# EAGLE design arm_new_v2 (EAGLE 7.5.0)
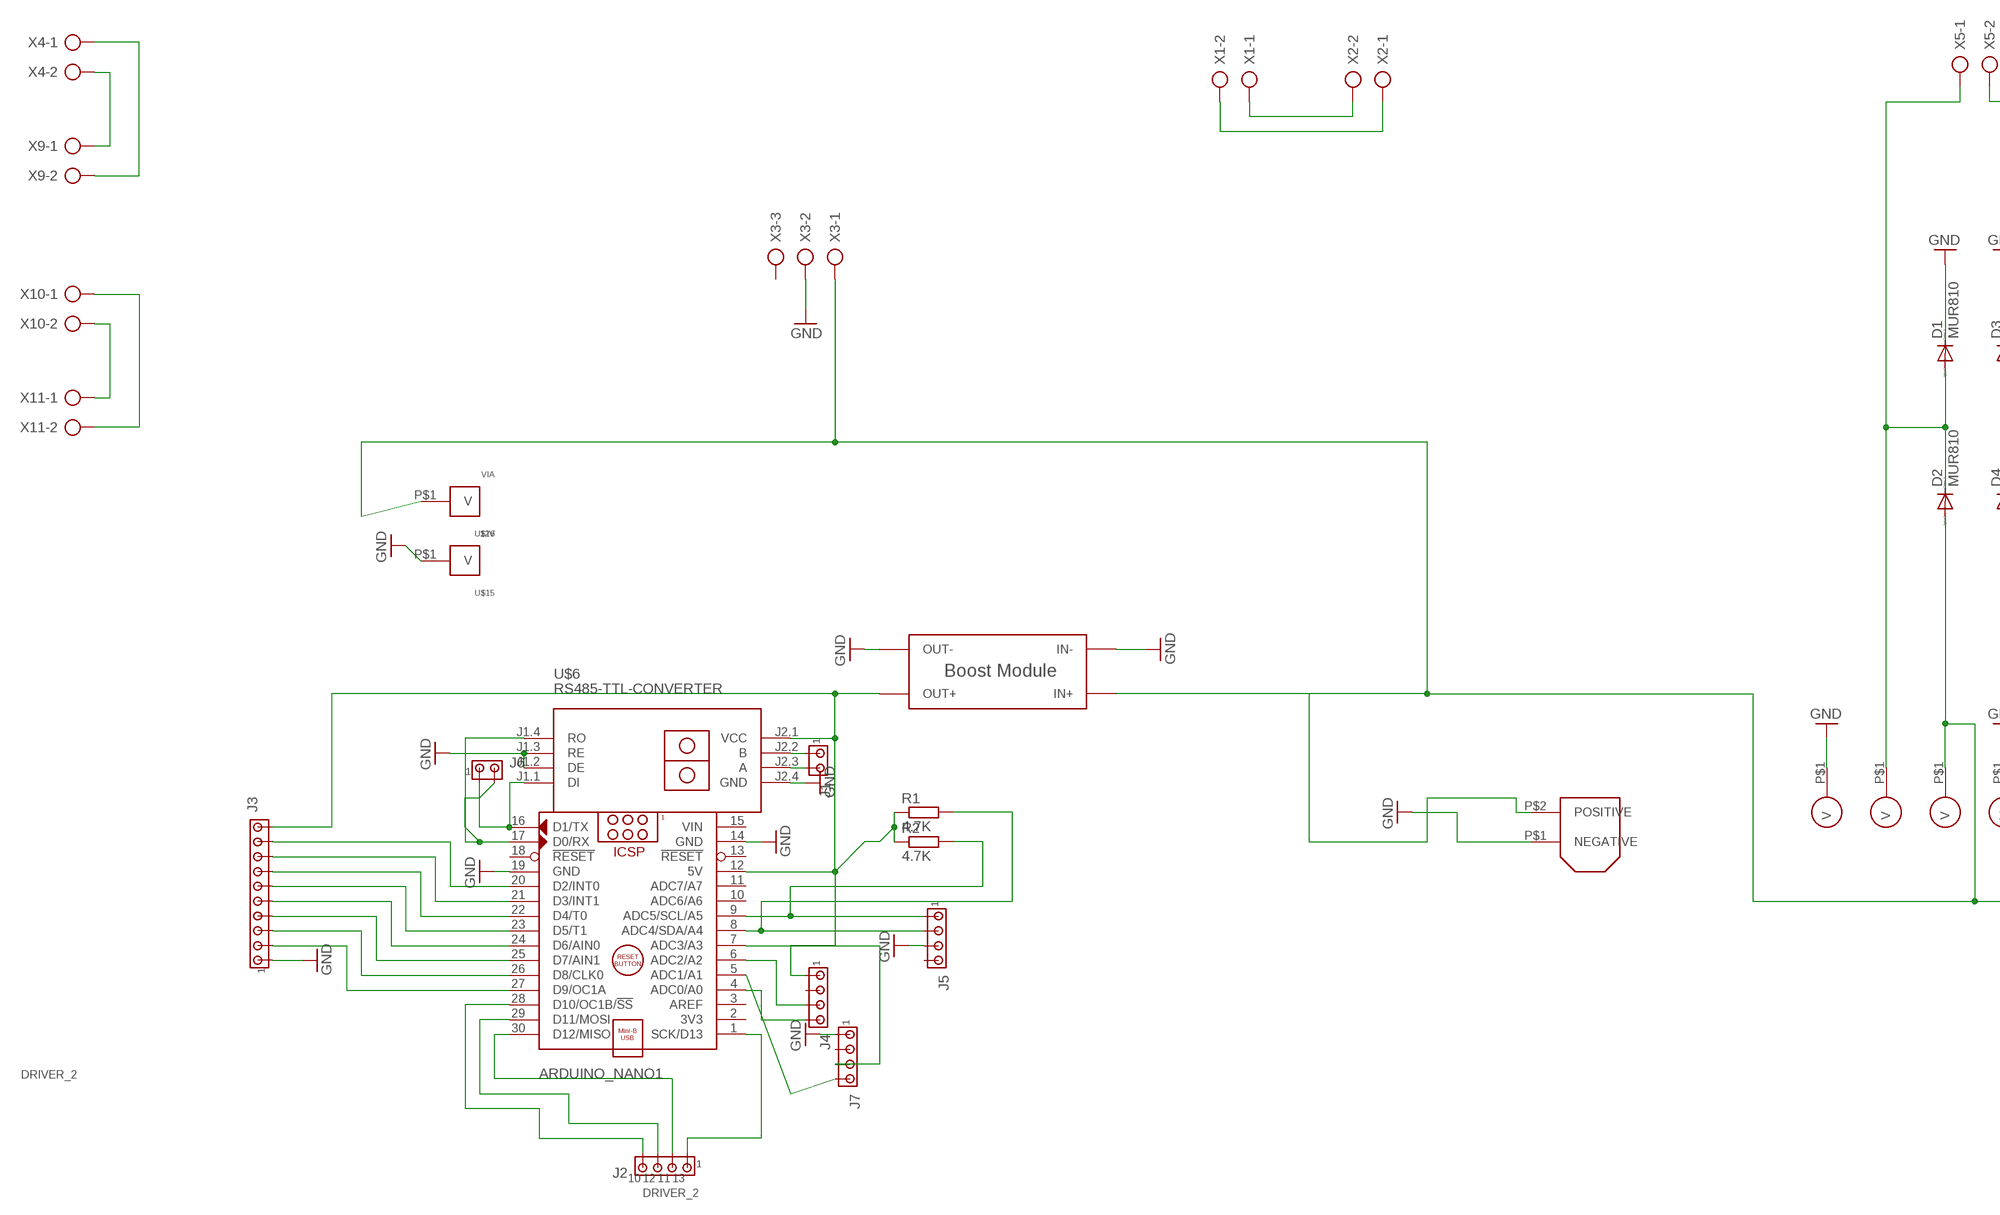
[diagram p0: schematic, sheet 1, part 1 of 2]
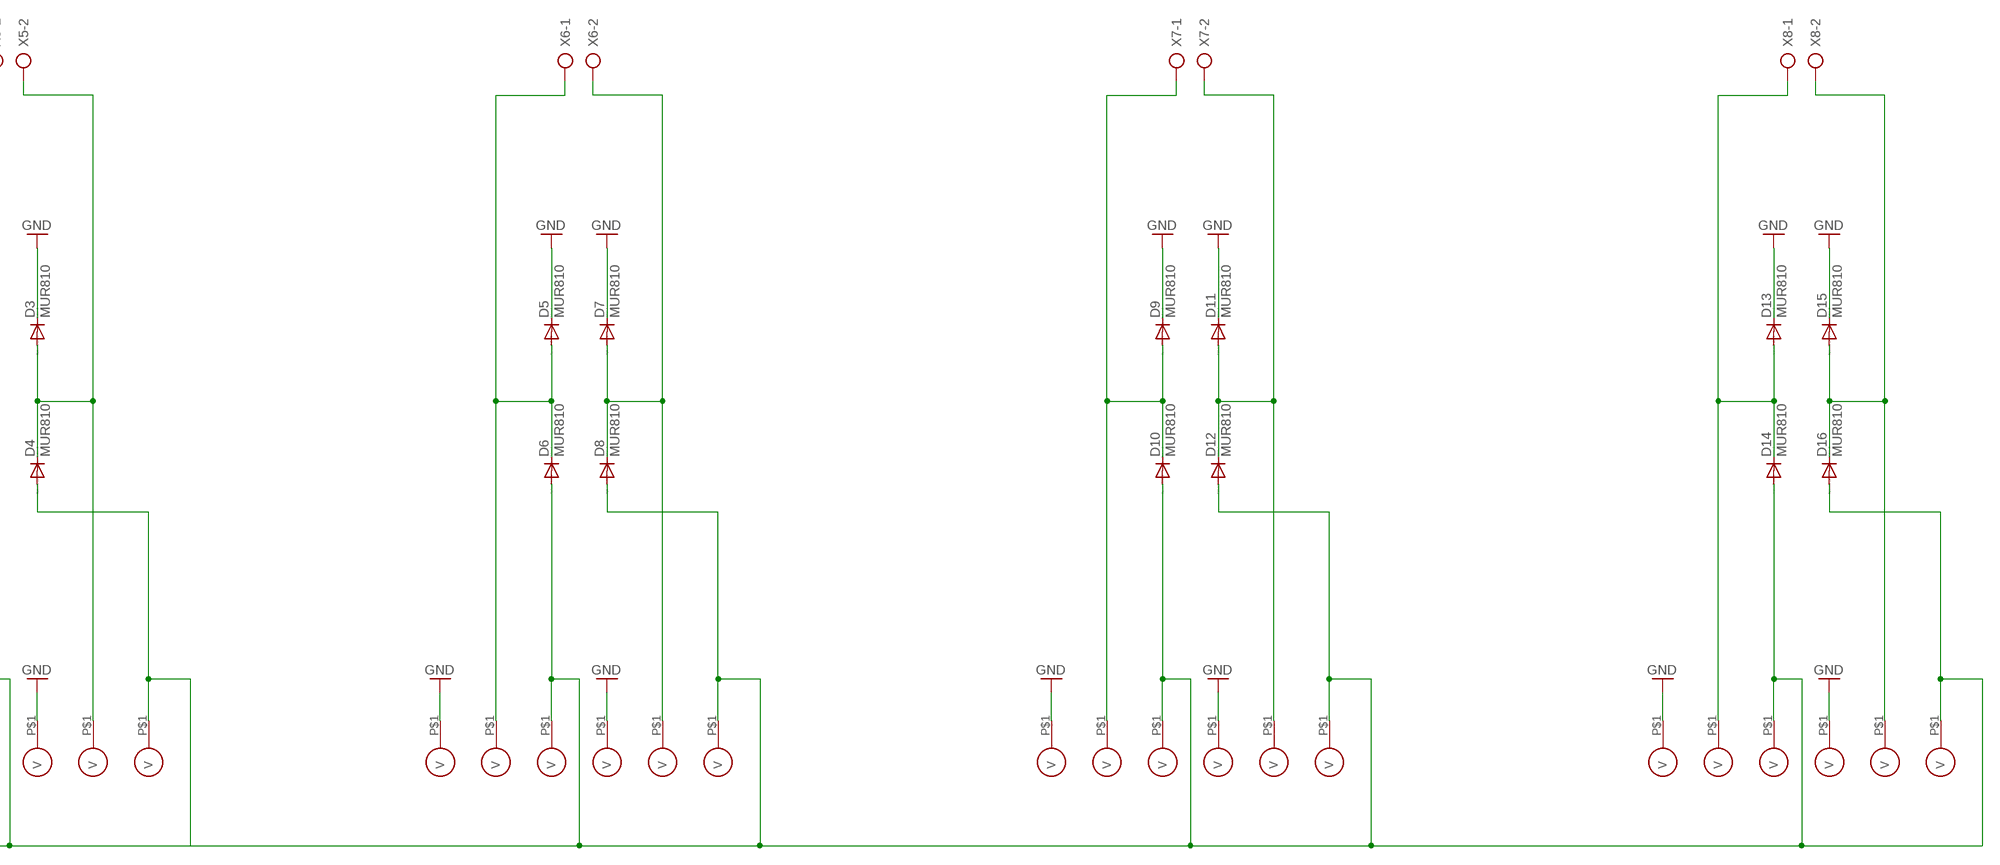
[diagram p1: schematic, sheet 1, part 2 of 2]

## Parts
ARDUINO_NANO1  ARDUINO_NANO  [ARDUINO_NANO]
D1  MUR810  [TO220ACS]
D2  MUR810  [TO220ACS]
D3  MUR810  [TO220ACS]
D4  MUR810  [TO220ACS]
D5  MUR810  [TO220ACS]
D6  MUR810  [TO220ACS]
D7  MUR810  [TO220ACS]
D8  MUR810  [TO220ACS]
D9  MUR810  [TO220ACS]
D10  MUR810  [TO220ACS]
D11  MUR810  [TO220ACS]
D12  MUR810  [TO220ACS]
D13  MUR810  [TO220ACS]
D14  MUR810  [TO220ACS]
D15  MUR810  [TO220ACS]
D16  MUR810  [TO220ACS]
J1  MTA02-100  [10X02MTA]
J2  MTA04-100  [10X04MTA]
J3  MTA10-100  [10X10MTA]
J4  MTA04-100  [10X04MTA]
J5  MTA04-100  [10X04MTA]
J6  MTA02-100  [10X02MTA]
J7  MTA04-100  [10X04MTA]
NO  NO  ROUND_VIA  [ROUND_VIA]
NO1  NO  ROUND_VIA  [ROUND_VIA]
NO2  NO  ROUND_VIA  [ROUND_VIA]
NO3  NO  ROUND_VIA  [ROUND_VIA]
R1  4.7K  R-EU_0204/7  [0204/7]
R2  4.7K  R-EU_0204/7  [0204/7]
U$1  BOOST_MODULE  [BOOST_MODULE]
U$4  XT60  [CONNECTOR]
U$6  RS485-TTL-CONVERTER  [RS485-TTL-CONVERTER]
U$15  12V  VIA  [VIA]
U$16  VIA  [VIA]
U$17  ROUND_VIA  [ROUND_VIA]
U$18  ROUND_VIA  [ROUND_VIA]
U$19  ROUND_VIA  [ROUND_VIA]
U$20  ROUND_VIA  [ROUND_VIA]
U$21  ROUND_VIA  [ROUND_VIA]
U$22  ROUND_VIA  [ROUND_VIA]
U$23  ROUND_VIA  [ROUND_VIA]
U$24  ROUND_VIA  [ROUND_VIA]
U$25  ROUND_VIA  [ROUND_VIA]
U$26  ROUND_VIA  [ROUND_VIA]
U$27  ROUND_VIA  [ROUND_VIA]
U$28  ROUND_VIA  [ROUND_VIA]
U$29  ROUND_VIA  [ROUND_VIA]
U$30  ROUND_VIA  [ROUND_VIA]
U$31  ROUND_VIA  [ROUND_VIA]
U$32  ROUND_VIA  [ROUND_VIA]
U$33  ROUND_VIA  [ROUND_VIA]
U$34  ROUND_VIA  [ROUND_VIA]
U$35  ROUND_VIA  [ROUND_VIA]
U$36  ROUND_VIA  [ROUND_VIA]
X1  AK300/2  [AK300/2]
X2  AK300/2  [AK300/2]
X3  AK300/3  [AK300/3]
X4  AK300/2  [AK300/2]
X5  AK300/2  [AK300/2]
X6  AK300/2  [AK300/2]
X7  AK300/2  [AK300/2]
X8  AK300/2  [AK300/2]
X9  AK300/2  [AK300/2]
X10  AK300/2  [AK300/2]
X11  AK300/2  [AK300/2]

## Nets
5V: ARDUINO_NANO1.12(5V) J3.10 J4.1 R1.1 R2.1 U$1.OUT+ U$6.J2.1(VCC)
GND: ARDUINO_NANO1.14(GND) ARDUINO_NANO1.19(GND) D1.C D3.C D5.C D7.C D9.C D11.C D13.C D15.C J3.1 J5.3 J7.1 NO1.P$1(V) NO2.P$1(V) NO3.P$1(V) NO.P$1(V) U$1.IN- U$1.OUT- U$4.P$1(NEGATIVE) U$6.J1.2(DE) U$6.J1.3(RE) U$6.J2.4(GND) U$15.P$1(V) U$20.P$1(V) U$24.P$1(V) U$29.P$1(V) U$34.P$1(V) X3.2
N$1: ARDUINO_NANO1.6(ADC2/A2) J4.3
N$2: ARDUINO_NANO1.4(ADC0/A0) J4.4
N$3: ARDUINO_NANO1.7(ADC3/A3) J7.3
N$4: ARDUINO_NANO1.5(ADC1/A1) J7.4
N$5: D2.A D4.A D6.A D8.A D10.A D12.A D14.A D16.A U$1.IN+ U$4.P$2(POSITIVE) U$16.P$1(V) U$19.P$1(V) U$22.P$1(V) U$23.P$1(V) U$26.P$1(V) U$28.P$1(V) U$31.P$1(V) U$33.P$1(V) U$36.P$1(V) X3.1
N$6: X4.2 X9.1
N$7: X4.1 X9.2
N$8: X10.2 X11.1
N$9: ARDUINO_NANO1.1(SCK/D13) J2.1
N$10: D1.A D2.C U$18.P$1(V) X5.1
N$11: ARDUINO_NANO1.30(D12/MISO) J2.2
N$12: ARDUINO_NANO1.20(D2/INT0) J3.9
N$13: ARDUINO_NANO1.29(D11/MOSI) J2.3
N$14: ARDUINO_NANO1.28(D10/OC1B/!SS) J2.4
N$15: ARDUINO_NANO1.21(D3/INT1) J3.8
N$16: ARDUINO_NANO1.22(D4/T0) J3.7
N$18: D5.A D6.C U$17.P$1(V) X6.1
N$19: ARDUINO_NANO1.23(D5/T1) J3.6
N$20: ARDUINO_NANO1.24(D6/AIN0) J3.5
N$21: ARDUINO_NANO1.25(D7/AIN1) J3.4
N$22: ARDUINO_NANO1.26(D8/CLK0) J3.3
N$23: ARDUINO_NANO1.27(D9/OC1A) J3.2
N$24: ARDUINO_NANO1.16(D1/TX) J6.1 U$6.J1.1(DI)
N$25: J1.1 U$6.J2.2(B)
N$26: ARDUINO_NANO1.9(ADC5/SCL/A5) J5.1 R2.2
N$27: ARDUINO_NANO1.8(ADC4/SDA/A4) J5.2 R1.2
N$31: D9.A D10.C U$27.P$1(V) X7.1
N$32: D3.A D4.C U$21.P$1(V) X5.2
N$34: D7.A D8.C U$25.P$1(V) X6.2
N$35: D13.A D14.C U$32.P$1(V) X8.1
N$37: D11.A D12.C U$30.P$1(V) X7.2
N$39: X10.1 X11.2
N$42: D15.A D16.C U$35.P$1(V) X8.2
N$43: X1.1 X2.2
N$47: ARDUINO_NANO1.17(D0/RX) J6.2 U$6.J1.4(RO)
N$49: J1.2 U$6.J2.3(A)
N$61: X1.2 X2.1
Unconnected: ARDUINO_NANO1.2(3V3) ARDUINO_NANO1.3(AREF) ARDUINO_NANO1.10(ADC6/A6) ARDUINO_NANO1.11(ADC7/A7) ARDUINO_NANO1.13(!RESET) ARDUINO_NANO1.18(!RESET) J4.2 J5.4 J7.2 X3.3

## Notes on the sheet
- DRIVER_2
- 10 | 12 | 11 | 13
- DRIVER_2

## Power pins joined to a net without a drawn wire
VIN: ARDUINO_NANO1.15(VIN)

## Library data of the parts
ARDUINO_NANO1 = ArduinoNanoV30:ARDUINO_NANO: Arduino Nano V3.0 Module Overview: The Arduino Nano is a small, complete, and breadboard-friendly board based on the ATmega328 (Arduino Nano 3.x) or ATmega168 (Arduino Nano 2.x). It has more or less the same functionality of the Arduino Duemilanove, but in a different package. It lacks only a DC power jack, and works with a Mini-B USB cable instead of a standard one. The Nano was designed and is being produced by Gravitech <http://www.gravitech.us/arna30wiatp.html>. General specifications: Item Value Microcontroller Atmel ATmega168 or ATmega328 Operating Voltage (logic level) 5 V Input Voltage (recommended) 7-12 V Input Voltage (limits) 6-20 V Digital I/O Pins 14 (of which 6 provide PWM output) Analog Input Pins 8 DC Current per I/O Pin 40 mA Flash Memory 16 KB (ATmega168) or 32 KB (ATmega328) of which 2 KB used by bootloader SRAM 1 KB (ATmega168) or 2 KB (ATmega328) EEPROM 512 bytes (ATmega168) or 1 KB (ATmega328) Clock Speed 16 MHz Dimensions (Inches) 0.73" x 1.70" Dimensions (mm) 18mm x 45mm Overall height About 9 mm (not including pins) Weigth 5 g Power: The Arduino Nano can be powered via the Mini-B USB connection, 6-20V unregulated external power supply (pin 30), or 5V regulated external power supply (pin 27). The power source is automatically selected to the highest voltage source. Memory: The ATmega168 has 16 KB of flash memory for storing code (of which 2 KB is used for the bootloader); the ATmega328 has 32 KB, (also with 2 KB used for the bootloader). The ATmega168 has 1 KB of SRAM and 512 bytes of EEPROM (which can be read and written with the EEPROM library); the ATmega328 has 2 KB of SRAM and 1 KB of EEPROM. Input and Output: Each of the 14 digital pins on the Nano can be used as an input or output, using pinMode(), digitalWrite(), and digitalRead() functions. They operate at 5 volts. Each pin can provide or receive a maximum of 40 mA and has an internal pull-up resistor (disconnected by default) of 20-50 kOhms. In addition, some pins have specialized functions. Visit Arduino - ArduinoBoardNano <https://www.arduino.cc/en/Main/ArduinoBoardNano>
D1-D16 = diode:MUR810: DIODE
J1 J6 = con-amp:MTA02-100: AMP connector
J2 J4 J5 J7 = con-amp:MTA04-100: AMP connector
J3 = con-amp:MTA10-100: AMP connector
NO NO1-NO3 U$17-U$36 = round_via:ROUND_VIA
R1 R2 = rcl:R-EU_: RESISTOR, European symbol
U$1 = Boost Module:BOOST_MODULE
U$4 = xt60_V2:XT60
U$6 = diy-modules:RS485-TTL-CONVERTER: RS485 to TTL converter based on MAX485 chip
U$15 U$16 = via:VIA
X1 X2 X4-X11 = con-ptr500:AK300/2: CONNECTOR; OC_FARNELL: unknown; OC_NEWARK: unknown
X3 = con-ptr500:AK300/3: CONNECTOR; OC_FARNELL: unknown; OC_NEWARK: unknown

## Board
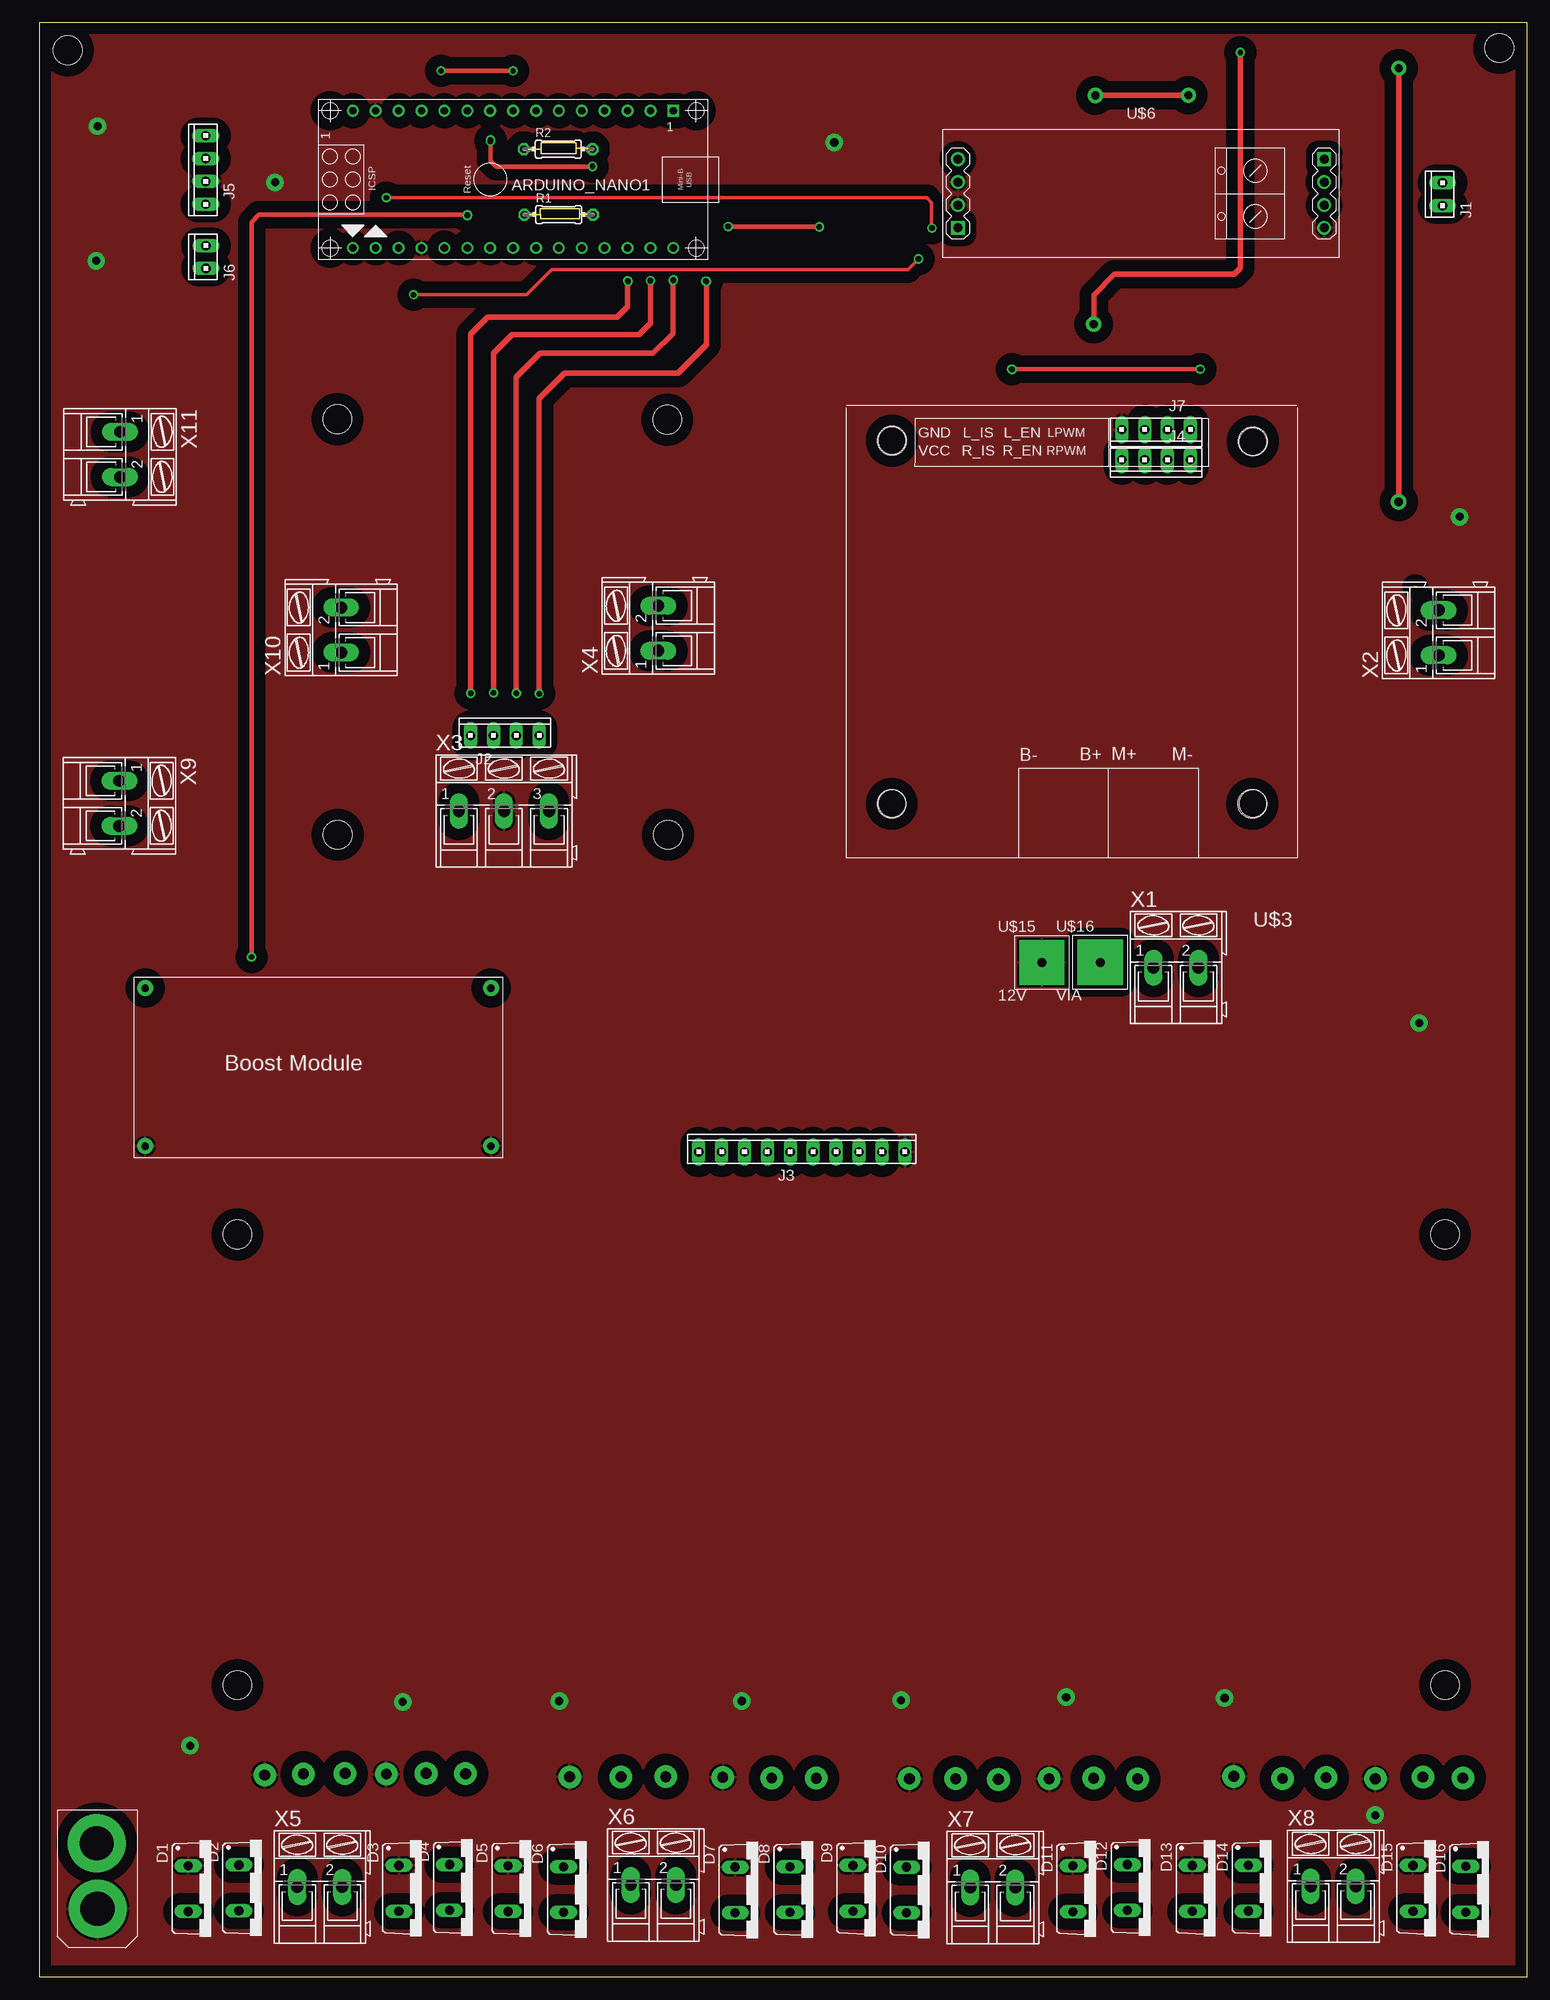
[diagram p2: board, top side]
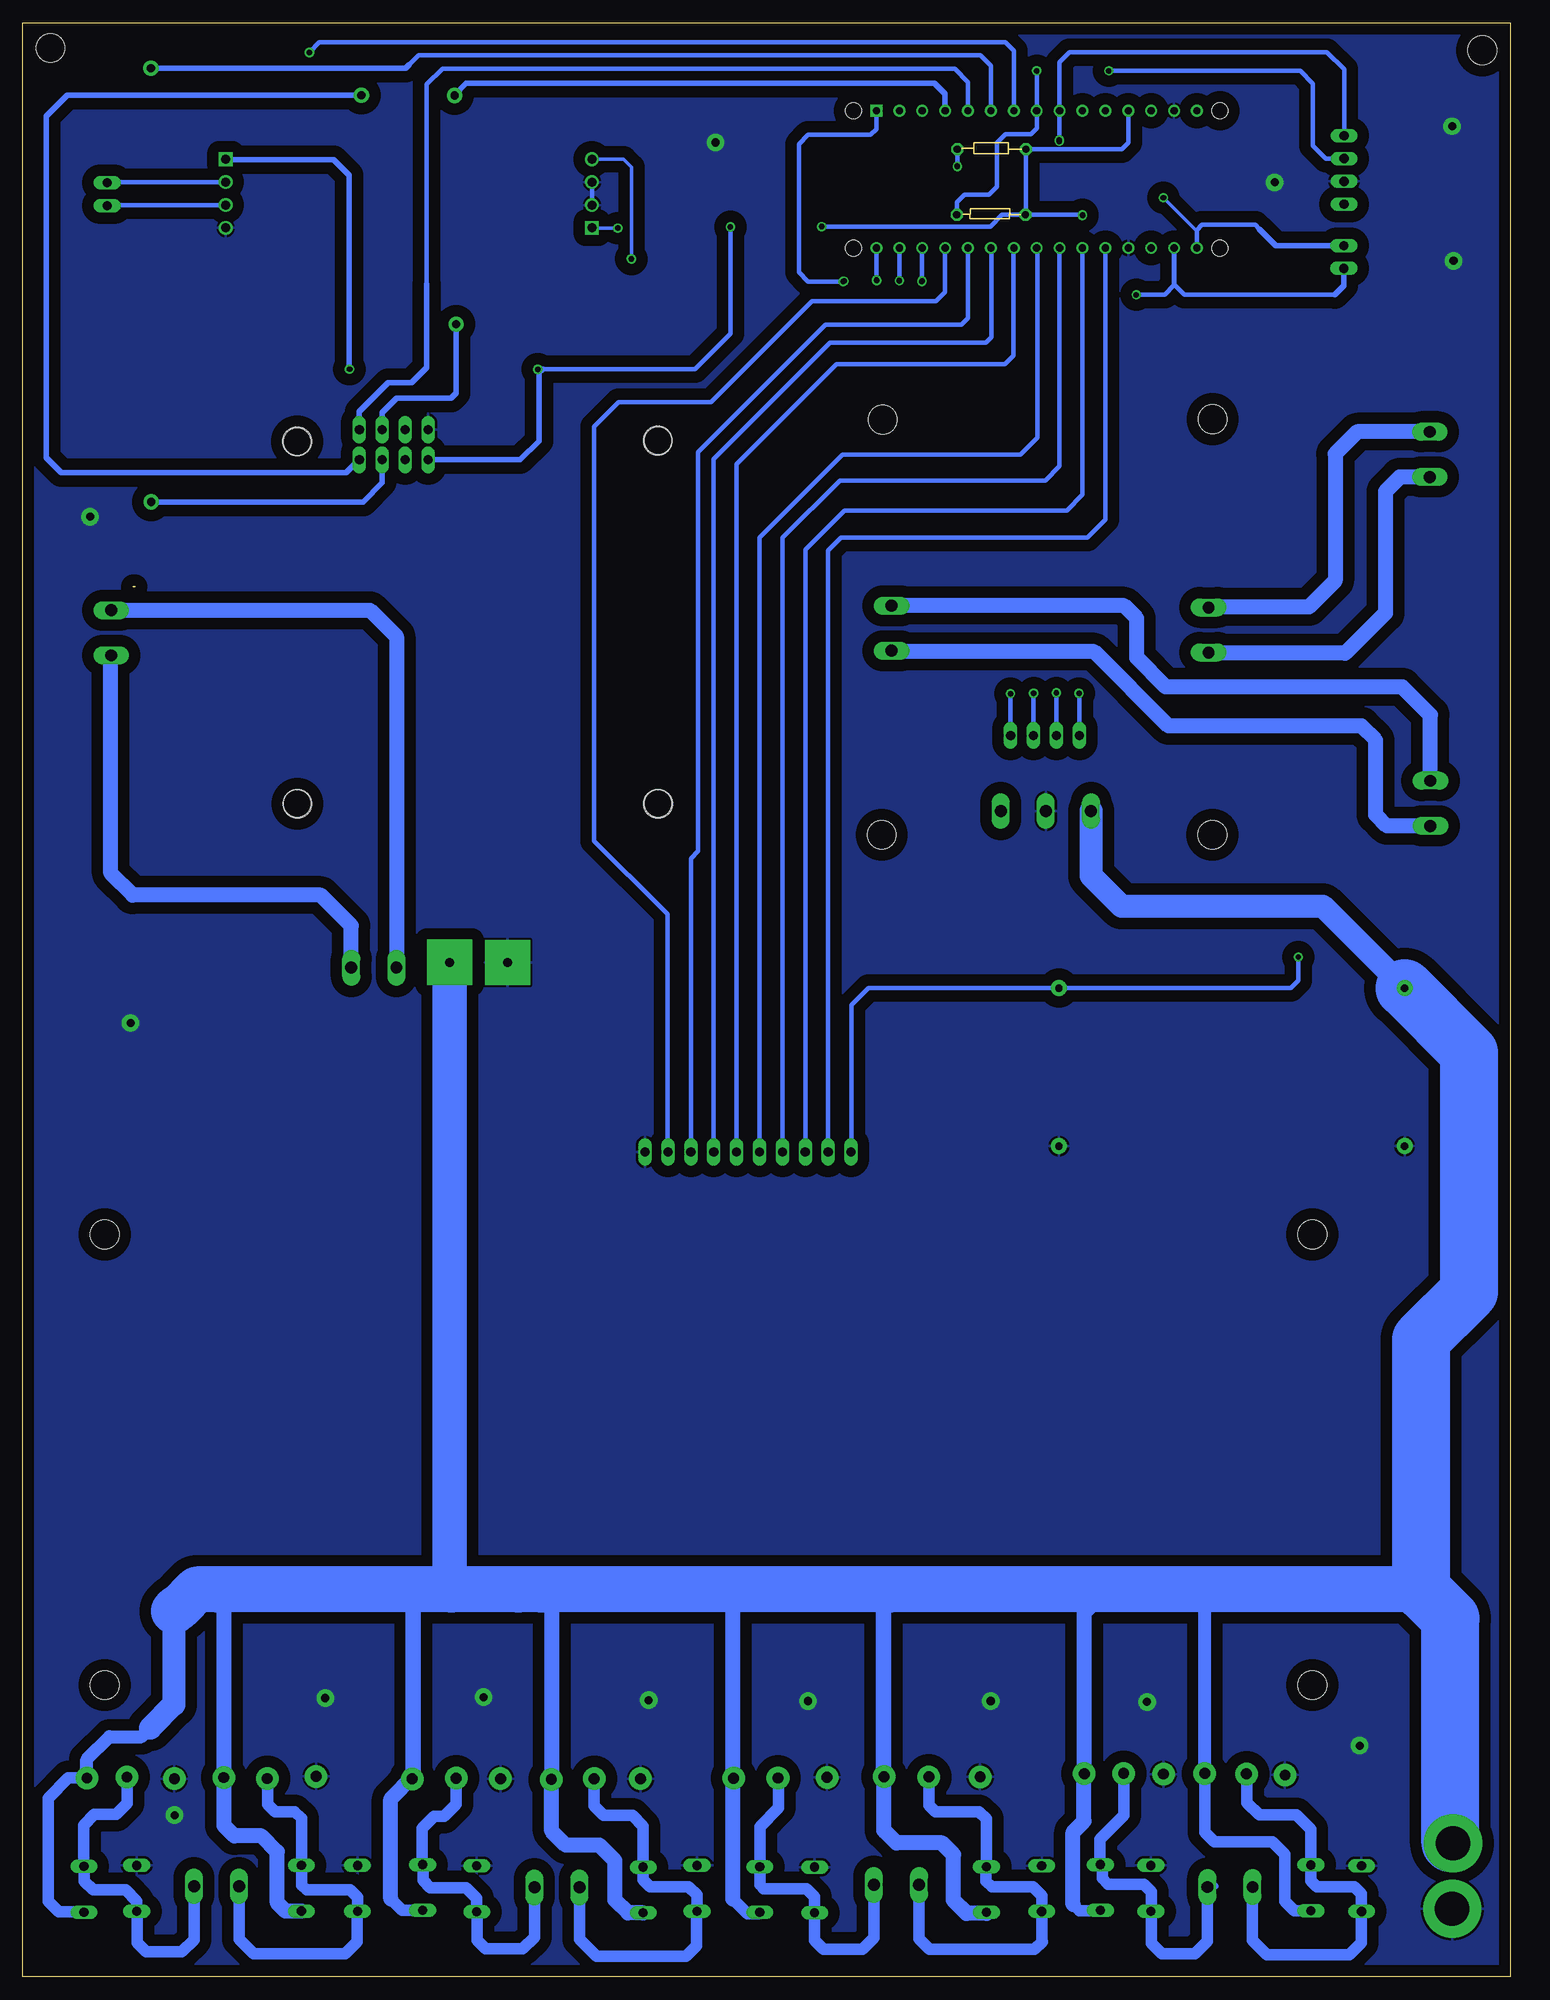
[diagram p3: board, bottom side, seen from below]

Size 165.08 x 216.84 mm. Coordinates in mm from the lower left corner, seen from the top.
Outline: 152.55,154.28 152.78,154.28
Outline: 54.25,202.79 55.68,202.79 55.68,203.5 59.51,203.5 59.51,202.92
Outline: 59.51,202.92 60.83,202.92 60.83,202.84
Outline: 55.68,202.74 55.68,202.31 59.51,202.31 59.51,202.92
Outline: 54.38,195.53 55.55,195.53 55.55,195.58
Outline: 55.55,195.58 55.55,196.16 59.92,196.16 59.92,195.58 60.76,195.58 60.76,195.56
Outline: 55.55,195.58 55.58,195.58 55.58,195.1 59.94,195.1 59.94,195.63
Outline: 0,0 165.08,0 165.08,216.84 0,216.84 0,0
Copper layers (1*16): Top 0.035mm / dielectric 1.5mm / Bottom 0.035mm
Design rules "default": minimum track width 10mil, minimum drill 24mil, track to track 8mil, track to pad 8mil, pad to pad 8mil, via to via 8mil, smd to smd 8mil, copper to edge 40mil, drill to drill 8mil, minimum pad ring 10mil, minimum via ring 8mil, stop-mask expansion 4mil, vias tented up to drill 0mil, thermal gap 10mil
Holes 3.2 mm at 155.96,82.38 155.96,32.38 21.96,32.38 21.96,82.38 33.05,172.85 69.65,172.77 33.07,126.72 69.75,126.72 94.59,170.46 134.62,170.36 94.56,130.15 134.57,130.15 3.12,213.77 161.98,214.02

### Footprints (pad centres in the part's own frame; a part is rotated, then mirrored left to right if it is on the bottom)
ARDUINO_NANO = drill 0.8 square: 1 -20.32,-7.62 | drill 0.8: 2 -17.78,-7.62; 3 -15.24,-7.62; 4 -12.7,-7.62; 5 -10.16,-7.62; 6 -7.62,-7.62; 7 -5.08,-7.62; 8 -2.54,-7.62; 9 0,-7.62; 10 2.54,-7.62; 11 5.08,-7.62; 12 7.62,-7.62; 13 10.16,-7.62; 14 12.7,-7.62; 15 15.24,-7.62; 16 15.24,7.62; 17 12.7,7.62; 18 10.16,7.62; 19 7.62,7.62; 20 5.08,7.62; 21 2.54,7.62; 22 0,7.62; 23 -2.54,7.62; 24 -5.08,7.62; 25 -7.62,7.62; 26 -10.16,7.62; 27 -12.7,7.62; 28 -15.24,7.62; 29 -17.78,7.62; 30 -20.32,7.62 | hole 1.778: -22.86,-7.62; -22.86,7.62; 17.78,7.62; 17.78,-7.62
TO220ACS = drill 1.016 long: A 2.54,-2.54; C -2.54,-2.54
10X02MTA = drill 1.016 long: 1 1.27,0; 2 -1.27,0
10X04MTA = drill 1.016 long: 1 3.81,0; 2 1.27,0; 3 -1.27,0; 4 -3.81,0
10X10MTA = drill 1.016 long: 1 11.43,0; 2 8.89,0; 3 6.35,0; 4 3.81,0; 5 1.27,0; 6 -1.27,0; 7 -3.81,0; 8 -6.35,0; 9 -8.89,0; 10 -11.43,0
ROUND_VIA = drill 1.2 pad 2.5: P$1 0,0
0204/7 = drill 0.813 octagon: 1 -3.81,0; 2 3.81,0
BOOST_MODULE = drill 0.8 pad 1.778: IN+ 1.27,18.796; IN- 1.27,1.27; OUT+ 39.624,18.796; OUT- 39.624,1.27
IBT-2 = hole 3: -8.001,12.954; 32.055,12.954; 32.029,-27.305; -8.001,-27.203
CONNECTOR = drill 3.81 pad 6.452: P$1 4.394,12.192; P$2 4.496,4.928
RS485-TTL-CONVERTER = drill 1 square: J1.1 -20.32,-3.81; J2.1 20.32,3.81 | drill 1: J1.2 -20.32,-1.27; J1.3 -20.32,1.27; J1.4 -20.32,3.81; J2.2 20.32,1.27; J2.3 20.32,-1.27; J2.4 20.32,-3.81
VIA = drill 1 pad 5 square: P$1 -4,3
AK300/2 = drill 1.321 long: 1 -2.515,0; 2 2.489,0
AK300/3 = drill 1.321 long: 1 -5.004,0; 2 0,0; 3 5.004,0

### Placement (x,y rotation side)
ARDUINO_NANO1  50.01,199.44 180 top
D1  19.05,9.8 270 top
D2  24.66,9.88 270 top
D3  42.42,9.83 270 top
D4  48.03,9.93 270 top
D5  54.53,9.8 270 top
D6  60.68,9.7 270 top
D7  79.73,9.65 270 top
D8  85.83,9.7 270 top
D9  92.79,9.83 270 top
D10  98.76,9.65 270 top
D11  117.22,9.78 270 top
D12  123.24,9.93 270 top
D13  130.45,9.83 270 top
D14  136.68,9.86 270 top
D15  154.94,9.83 270 top
D16  160.81,9.73 270 top
J1  155.68,197.79 90 top
J2  51.64,137.74 0 top
J3  84.58,91.54 0 top
J4  123.9,168.33 180 top
J5  18.44,200.48 90 top
J6  18.47,190.83 90 top
J7  123.9,171.68 180 top
NO  38.48,22.5 0 top
NO1  58.83,22.2 0 top
NO2  96.52,22 0 top
NO3  132.51,22.25 0 top
R1  57.61,195.53 0 top
R2  57.56,202.79 0 top
U$1  10.46,90.91 0 top
U$3  [IBT-2]  126.62,143.13 180 top
U$4  10.85,19.76 180 top
U$6  122.22,197.87 0 top
U$15  115.24,109.55 0 top
U$16  121.69,109.58 0 top
U$17  64.52,22.2 0 top
U$18  29.29,22.53 0 top
U$19  33.91,22.58 0 top
U$20  24.99,22.4 0 top
U$21  42.9,22.58 0 top
U$22  47.27,22.56 0 top
U$23  86.18,22.05 0 top
U$24  75.82,22.15 0 top
U$25  81.25,22.07 0 top
U$26  69.49,22.23 0 top
U$27  101.65,22 0 top
U$28  121.84,21.97 0 top
U$29  112.04,22 0 top
U$30  116.97,22.05 0 top
U$31  106.4,21.92 0 top
U$32  137.92,22.02 0 top
U$33  142.75,22.12 0 top
U$34  148.23,22 0 top
U$35  153.49,22.17 0 top
U$36  157.94,22.07 0 top
X1  126.11,111.99 0 top
X2  155.24,149.15 90 top
X3  51.54,129.36 0 top
X4  68.66,149.66 90 top
X5  31.11,9.98 0 top
X6  68.12,10.21 0 top
X7  105.79,9.93 0 top
X8  143.56,10.06 0 top
X9  8.86,130.2 270 top
X10  33.48,149.45 90 top
X11  8.94,168.91 270 top

### Tracks (layer width: path | path; a pad name or v marks a point on that pad's centre or on a via)
5V  (via drill 0.6)
  Top 0.508: v47.47,195.5 24.33,195.5 23.52,194.69 v23.52,113.16 | v76.38,194.21 86.49,194.21 v86.54,194.16 | v107.87,178.38 v128.78,178.38 v128.83,178.38
  Bottom 0.508: ARDUINO_NANO1.12 42.39,203.5 43.1,202.79 R2.1 53.75,195.58 R1.1 | 73.1,91.59 73.1,107.83 71.22,109.7 50.7,109.7 | 50.7,109.7 U$1.OUT+ | R1.1 47.5,195.53 v47.47,195.5 | v23.52,113.16 23.52,110.57 24.36,109.73 50.67,109.73 50.7,109.7 | R1.1 56.39,195.53 57.71,194.21 v76.38,194.21 | v86.54,194.16 86.54,182.32 90.45,178.41 107.34,178.41 107.85,178.41 v107.87,178.38
  Bottom 0.61: 73.1,91.59 J3.10 | 107.9,178.36 v107.87,178.38 | J4.1 109.86,168.33 107.77,170.41 107.77,177.98 107.34,178.41 | v128.83,178.38 128.83,199.9 130.56,201.62 142.49,201.62 U$6.J2.1
GND  (via drill 0.9 pad 1.93)
  Bottom 0.508: U$6.J1.3 U$6.J1.2
  other vias: 16.71,25.65 40.31,30.51 57.66,30.61 77.93,30.61 95.61,30.71 113.92,31.04 131.5,30.94 148.21,17.96 153.09,105.84 157.58,162 6.3,190.4 6.45,205.33 26.14,199.11 88.19,203.53
  pour Bottom (isolate 1.27): 0,217.17 165.1,217.17 165.1,0 0,0
  pour Top (isolate 1.27): 0,217.17 166.37,217.17 166.37,0 0,0
N$1  (via drill 0.9 pad 1.68)
  Top 0.61: v150.8,163.65 150.8,211.73 v150.82,211.76
  Bottom 0.508: ARDUINO_NANO1.6 57.63,212.04 58.8,213.21 121.13,213.21 122.16,212.18
  Bottom 0.61: J4.3 125.17,165.79 127.31,163.65 v150.8,163.65 | v150.82,211.76 122.58,211.76 122.16,212.18
N$2  (via drill 0.9 pad 1.68)
  Top 0.61: v117.14,208.79 v127.48,208.79
  Bottom 0.61: ARDUINO_NANO1.4 62.71,208.91 63.88,210.08 115.85,210.08 v117.14,208.79 | v127.48,208.79 160.12,208.79 162.46,206.45 162.46,168.55 160.78,166.88 129.16,166.88 J4.4
N$3  (via drill 0.6, 0.9 pad 1.68)
  Top 0.61: v133.25,213.54 133.22,213.51 133.22,189.56 132.56,188.9 119.28,188.9 116.97,186.59 v116.97,183.36
  Bottom 0.508: ARDUINO_NANO1.7 55.09,213.72 56.01,214.63 132.16,214.63 v133.25,213.54
  Bottom 0.61: J7.3 125.17,173.58 123.6,175.16 117.53,175.16 116.97,175.72 v116.97,183.36
N$4
  Bottom 0.508: ARDUINO_NANO1.5 60.17,210.24 61.65,211.71 118.49,211.71 120.22,209.98 120.22,187.83 120.22,187.3
  Bottom 0.61: J7.4 127.71,173.66 124.51,176.86 121.92,176.86 120.22,178.56 120.22,187.83
N$5
  Bottom 1.27: U$26.P$1 69.44,22.17 69.44,16.03 68.17,14.76 62.92,14.76 61.75,13.59 61.75,8.38 60.53,7.16 D6.A 58.14,7.09 58.12,7.06 60.4,7.06 61.72,8.38 61.72,13.54 62.99,14.81 68.3,14.81 69.52,16.03 69.52,16.26 | U$22.P$1 47.27,17.17 48.51,15.93 48.51,8.03 47.83,7.34 45.54,7.34 D4.A | D2.A 23.98,7.34 25.02,8.38 25.02,13.61 26.39,14.99 32.84,14.99 33.88,16.03 33.88,22.55 U$19.P$1 | U$23.P$1 86.21,22.05 86.26,22 86.26,8.64 84.66,7.04 83.41,7.04 D8.A | D10.A 97.33,7.11 97.41,7.19 98.17,7.19 99.42,8.43 99.42,13.03 101.04,14.66 105.05,14.66 106.38,15.98 106.38,16.18 106.38,21.89 U$31.P$1 | U$28.P$1 122.07,21.97 124.23,19.81 124.23,8.66 122.96,7.39 D12.A | D14.A 136.14,7.32 136.98,8.15 136.98,14.17 138.51,15.7 141.71,15.7 142.75,16.74 U$33.P$1 | U$36.P$1 160,22.07 162.23,19.84 162.23,8.41 161.04,7.21 158.29,7.21 D16.A | 69.52,21.87 69.52,22.12 69.44,22.2 69.44,41.48 68.94,41.99 | 46.66,41.99 46.46,41.78
  Bottom 1.422: U$19.P$1 33.91,41.27 33.91,41.55 34.14,41.78 | U$22.P$1 47.27,41.53 47.52,41.78 46.46,41.78 | 69.44,16.03 69.44,22.2 69.44,41.6 68.96,42.09 | 85.45,42.09 86.08,41.45 | 86.08,41.45 86.18,41.35 U$23.P$1 | U$31.P$1 106.4,40.89 | 106.4,40.89 106.4,41.48 106.17,41.71 | 86.33,41.71 86.08,41.45 | U$28.P$1 121.84,40.89 | 121.84,40.89 121.84,41.3 121.54,41.6 | 107.11,41.6 106.4,40.89 | U$33.P$1 142.75,40.87 142.22,41.4 142.32,41.5 | 122.35,41.4 121.84,40.89 | U$36.P$1 157.94,24.13 155.42,26.64 151.87,26.64 150.88,27.64 149.43,29.08
  Bottom 1.676: D14.A 135.89,7.32 136.8,8.23 136.8,13.89 138.56,15.65 141.58,15.65 142.72,16.79 142.72,22.35 142.7,22.38 142.7,42.32 143.38,43 | 124.23,8.66 124.23,19.74 121.67,22.3 121.67,42.14 121.44,42.37 119.91,42.37 119,41.45 111.61,41.45 110.06,43 | D10.A 97.92,7.11 99.34,8.53 99.34,12.9 101.07,14.63 104.83,14.63 106.38,16.18 106.38,22.05 106.32,22.1 106.32,41.81 107.52,43 | 86.26,8.64 86.26,43.13 85.83,43.56 81.48,43.56 80.39,42.47 70.21,42.47 69.67,43 | 58.12,7.06 60.3,7.06 | 60.3,7.06 61.77,8.53 61.77,13.59 63.04,14.86 63.09,14.86 | 63.09,14.86 68.1,14.86 | 68.1,14.86 69.49,16.26 69.49,22 69.55,22.05 69.55,40.97 70.23,41.66 70.21,41.66 68.86,43 | 48.51,8.03 48.51,16.05 47.3,17.27 47.3,22.96 47.24,23.01 47.24,40.44 45.74,41.94 36.17,41.94 36.17,42.14 34.75,43.56 34.75,42.11 33.91,41.27 | 60.3,7.06 60.35,7.06 61.8,8.51 61.8,13.56 63.09,14.86 | 68.1,14.86 68.12,14.86 69.52,16.26 69.52,21.87 69.52,41.71 68.76,42.47 48.21,42.47 47.52,41.78
  Bottom 2.54: 148.28,40.59 148.28,30.23 150.88,27.64 | X3.1 46.53,122.2 43.13,118.8 20.83,118.8 U$1.IN+
  Bottom 3.81: U$16.P$1 117.69,44.23 117.83,44.09 117.83,43.31 117.53,43
  Bottom 5.08: 9.72,42.84 9.88,43 68.86,43 69.67,43 107.52,43 110.06,43 117.53,43 143.38,43 145.75,43 147.83,40.92 147.96,40.92 148.28,40.59
  Bottom 6.452: 9.88,43 9.88,70.71 4.57,76.02 4.57,102.54 U$1.IN+ | 9.72,42.84 6.66,39.78 6.66,14.83 U$4.P$2
N$6
  Bottom 1.676: X9.1 8.87,140.03 11.96,143.13 38.23,143.13 41.45,146.35 41.45,150.75 42.85,152.15 X4.2
N$7
  Bottom 1.676: X9.2 13.69,127.71 14.94,128.96 14.94,137.21 16.51,138.79 37.92,138.79 46.18,147.04 68.56,147.04 X4.1
N$8
  Bottom 1.676: X11.1 16.99,171.43 19.43,168.99 19.43,154.91 22.35,151.99 33.43,151.99 X10.2
N$9  (via drill 0.6)
  Top 0.61: v55.45,142.37 55.45,175.13 58.24,177.93 70.84,177.93 74.02,181.1 v74.02,188.11
  Bottom 0.508: J2.1 v55.45,142.37 | v74.02,188.11 77.93,188.11 78.94,189.13 78.94,203.35 77.93,204.37 70.99,204.37 70.33,205.03 ARDUINO_NANO1.1
N$10
  Bottom 0.61: 29.31,22.5 U$18.P$1
  Bottom 1.27: U$18.P$1 29.21,22.45 29.21,19.33 27.86,17.98 23.75,17.98 22.12,16.36 D2.C 22.12,10.67 21.46,10.01 17.3,10.01 16.51,9.22 D1.A 16.56,7.21 16.56,3.79 17.86,2.49 27.03,2.49 28.6,4.06 X5.1
N$11  (via drill 0.6)
  Top 0.61: v52.91,142.42 52.91,177.52 55.52,180.14 68.1,180.14 70.28,182.32 70.28,188.24 v70.33,188.29
  Bottom 0.508: J2.2 v52.91,142.42 | v70.33,188.29 ARDUINO_NANO1.30
N$12
  Bottom 0.508: ARDUINO_NANO1.20 44.93,161.7 46.94,159.69 74.27,159.69 75.69,158.27 J3.9
N$13  (via drill 0.6)
  Top 0.61: v50.37,142.44 50.37,180.16 52.43,182.22 66.52,182.22 67.79,183.49 v67.79,188.19
  Bottom 0.508: J2.3 v50.37,142.44 | v67.79,188.19 ARDUINO_NANO1.29
N$14  (via drill 0.6)
  Top 0.61: v47.85,142.42 47.85,182.27 49.71,184.12 64.11,184.12 65.28,185.29 65.28,188.06 v65.3,188.09
  Bottom 0.508: J2.4 47.83,142.39 v47.85,142.42 | v65.3,188.09 65.3,191.77 ARDUINO_NANO1.28
N$15
  Bottom 0.508: J3.8 78.23,158.35 73.86,162.71 49.23,162.71 47.47,164.47 ARDUINO_NANO1.21
N$16
  Bottom 0.508: J3.7 80.77,159.67 74.4,166.04 51.61,166.04 50.04,167.62 50.04,191.79 ARDUINO_NANO1.22
N$18
  Bottom 1.27: U$17.P$1 64.49,22.17 64.49,19.02 63.8,18.34 58.95,18.34 58.14,17.53 D6.C 58.17,12.22 58.17,10.64 57.51,9.98 52.96,9.98 51.99,9.02 D5.A 51.99,3.96 51.94,3.91 52.78,3.07 64.44,3.07 65.61,4.24 X6.1
N$19
  Bottom 0.508: J3.6 83.31,159.69 74.12,168.88 54.38,168.88 52.48,170.79 52.48,191.75 ARDUINO_NANO1.23
N$20
  Bottom 0.508: J3.5 85.85,167.85 74.75,178.94 56.08,178.94 55.14,179.88 55.14,191.77 ARDUINO_NANO1.24
N$21
  Bottom 0.508: J3.4 88.39,168.41 75.49,181.31 58.19,181.31 57.58,181.91 57.58,191.77 ARDUINO_NANO1.25
N$22
  Bottom 0.508: J3.3 90.93,124.08 90.12,124.89 90.12,169.19 76,183.31 60.88,183.31 60.17,184.02 ARDUINO_NANO1.26
N$23
  Bottom 0.508: J3.2 93.52,91.6 93.52,117.91 97.87,122.25 97.92,122.25 101.68,126.01 101.68,171.98 98.96,174.7 88.7,174.7 77.5,185.9 63.75,185.9 62.71,186.94 ARDUINO_NANO1.27
N$24  (via drill 0.6)
  Top 0.406: v38.48,197.41 98.45,197.41 98.98,196.88 98.98,194.06 v99.01,194.03
  Bottom 0.406: 34.77,193.83 34.9,193.83 v38.48,197.41 | v99.01,194.03 101.88,194.03 U$6.J1.1
  Bottom 0.508: 27.38,193.47 27.84,193.93 28.3,194.39 34.21,194.39 34.77,193.83 ARDUINO_NANO1.16
  Bottom 0.61: J6.1 26.01,192.1 27.84,193.93
N$25
  Bottom 0.508: U$6.J2.2 155.6,199.14 J1.1
N$26  (via drill 0.6)
  Top 0.508: v50.04,203.81 50.04,201.47 50.65,200.86 v61.37,200.86
  Bottom 0.508: J5.1 18.44,211.63 20.34,213.54 48.92,213.54 50.04,212.42 50.04,207.09 | 50.04,207.09 ARDUINO_NANO1.9 | 50.04,207.09 v50.04,203.81 | v61.37,200.86 R2.2
N$27  (via drill 0.6)
  Top 0.508: v44.55,211.48 v52.55,211.48
  Bottom 0.508: J5.2 20.45,201.75 21.89,203.2 21.89,210.06 23.32,211.48 v44.55,211.48 | v52.55,211.48 ARDUINO_NANO1.8 52.53,207.03 52.53,205.13 53.21,204.44 56.03,204.44 56.95,203.53 56.95,198.65 57.86,197.74 60.58,197.74 61.42,196.9 R1.2
N$31
  Bottom 1.27: U$27.P$1 101.68,21.97 101.68,18.97 100.64,17.93 97.41,17.93 96.22,16.74 D10.C 96.22,10.79 95.45,10.03 91.19,10.03 90.25,9.09 D9.A 90.27,7.26 90.27,3.48 91.47,2.29 101.4,2.29 103.28,4.17 X7.1
N$32
  Bottom 0.61: X5.2 32.66,10.08 32.74,10.16
  Bottom 1.27: U$21.P$1 42.9,17.93 45.54,15.29 45.54,12.52 D4.C 45.49,12.52 45.29,12.72 45.29,10.95 44.63,10.29 40.66,10.29 39.83,9.45 39.83,7.34 D3.A 39.83,7.24 39.83,3.76 38.66,2.59 34.98,2.59 33.6,3.96 X5.2
N$34
  Bottom 1.27: U$25.P$1 81.25,21.79 81.2,21.74 81.2,18.75 83.26,16.69 83.26,12.27 D8.C | D8.C 83.29,12.42 83.36,12.5 | D8.C 83.26,12.22 83.26,10.21 82.86,9.8 78.08,9.8 77.19,8.91 D7.A 77.19,4.09 76.2,3.1 71.88,3.1 70.61,4.37 X6.2
N$35
  Bottom 1.27: U$32.P$1 137.87,21.97 137.87,19.18 137.03,18.34 134.87,18.34 134.14,17.6 D14.C 134.09,12.34 134.09,10.19 133.58,9.68 128.73,9.68 127.91,8.87 D13.A 127.97,7.24 127.97,3.91 129.29,2.59 139.45,2.59 141.05,4.19 X8.1
N$37
  Bottom 1.27: U$30.P$1 116.97,19.15 118.29,17.83 119.43,17.83 120.75,16.51 120.75,12.52 D12.C 120.65,12.42 120.65,10.72 119.84,9.91 115.85,9.91 114.68,8.74 D11.A 114.63,7.19 114.63,4.06 113.69,3.12 109.58,3.12 108.28,4.42 X7.2
N$39
  Bottom 1.676: X11.2 12.27,166.42 13.87,164.82 13.87,151.31 18.31,146.86 33.4,146.86 X10.1
N$42
  Bottom 1.27: X8.2 146.05,4.14 147.4,2.79 151.36,2.79 152.38,3.81 152.38,7.26 D15.A 152.4,8.41 153.65,9.65 157.23,9.65 158.22,10.64 158.22,12.22 D16.C 158.29,12.29 158.29,16.84 157.1,18.03 154.71,18.03 153.49,19.25 U$35.P$1
N$43
  Bottom 1.676: X2.2 126.52,151.64 123.6,148.72 X1.1 | X1.1 123.6,111.53 123.67,111.45 123.67,111.91 X1.1
N$47  (via drill 0.6)
  Top 0.406: v41.5,186.64 54.05,186.64 56.84,189.43 96.34,189.43 v97.51,190.6
  Bottom 0.406: v97.51,190.6 97.51,200.79 98.4,201.68 U$6.J1.4
  Bottom 0.508: 19.46,186.64 36.14,186.64 37.29,187.78 37.29,191.79 ARDUINO_NANO1.17 37.31,187.68 38.35,186.64 v41.5,186.64
  Bottom 0.61: J6.2 18.47,187.63 19.46,186.64
N$48  (via drill 0.9 pad 1.68)
  other vias: 117.14,208.71
N$49
  Bottom 0.508: U$6.J2.3 155.6,196.6 J1.2
N$61
  Bottom 1.676: X1.2 128.6,116.64 131.98,120.02 152.88,120.02 155.3,122.43 155.3,146.58 X2.1
N$62  (via drill 0.6)
  other vias: 50.37,142.47
N$63  (via drill 0.6)
  other vias: 52.88,142.44
N$65  (via drill 0.6)
  other vias: 65.28,188.19
N$66  (via drill 0.6)
  other vias: 67.79,188.21
N$67  (via drill 0.6)
  other vias: 70.31,188.21
N$69  (via drill 0.6)
  other vias: 73.91,188.16
N$74  (via drill 0.6)
  other vias: 50.04,203.66
N$75  (via drill 0.6)
  other vias: 61.37,200.91
N$76  (via drill 0.6)
  other vias: 133.25,213.51
N$77  (via drill 0.6)
  other vias: 97.54,190.63
N$78  (via drill 0.6)
  other vias: 38.51,197.41
N$79  (via drill 0.6)
  other vias: 99.03,194.03
N$82  (via drill 0.6)
  other vias: 47.47,195.43
N$83  (via drill 0.6)
  other vias: 76.43,194.21
N$84  (via drill 0.6)
  other vias: 86.54,194.18
N$85  (via drill 0.6)
  other vias: 107.92,178.36
N$86  (via drill 0.9 pad 1.68)
  other vias: 150.8,163.68
N$88  (via drill 0.9 pad 1.68)
  other vias: 116.99,183.39

### Text on the board
Unrouted: SCL | SDA | GND | USB | RS485 | TX | RX | TEAM INTERPLANETAR | INPUT